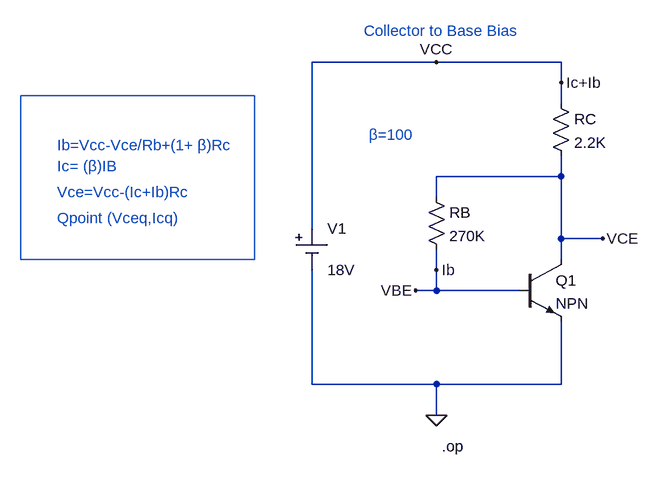
[diagram p0: schematic collector_base_bias.asc]
collector_base_bias.asc, the LTspice schematic file:
Version 4
SHEET 1 880 680
WIRE 288 0 96 0
WIRE 480 0 288 0
WIRE 480 32 480 0
WIRE 480 64 480 32
WIRE 480 176 480 144
WIRE 480 176 288 176
WIRE 288 208 288 176
WIRE 96 256 96 0
WIRE 480 272 480 176
WIRE 544 272 480 272
WIRE 480 304 480 272
WIRE 288 320 288 288
WIRE 288 352 288 320
WIRE 288 352 256 352
WIRE 416 352 288 352
WIRE 96 496 96 320
WIRE 288 496 96 496
WIRE 480 496 480 400
WIRE 480 496 288 496
WIRE 288 544 288 496
FLAG 288 544 0
FLAG 288 0 VCC
FLAG 544 272 VCE
FLAG 256 352 VBE
FLAG 288 320 Ib
FLAG 480 32 Ic+Ib
SYMBOL npn 416 304 R0
SYMATTR InstName Q1
SYMBOL res 272 192 R0
SYMATTR InstName RB
SYMATTR Value 270K
SYMBOL res 464 48 R0
SYMATTR InstName RC
SYMATTR Value 2.2K
SYMBOL Misc/cell 96 256 R0
SYMATTR InstName V1
SYMATTR Value 18V
TEXT 296 592 Left 2 !.op
TEXT 176 -48 Left 2 ;Collector to Base Bias
TEXT -296 128 Left 2 ;Ib=Vcc-Vce/Rb+(1+ β)Rc
TEXT -296 160 Left 2 ;Ic= (β)IB
TEXT -296 200 Left 2 ;Vce=Vcc-(Ic+Ib)Rc
TEXT -296 240 Left 2 ;Qpoint (Vceq,Icq)
TEXT 184 112 Left 2 ;β=100
RECTANGLE Normal -352 52 8 304

The netlist it stands for:
* collector_base_bias.asc
Q1 VCE Ib 0 0 NPN
RB VCE Ib 270K
RC Ic+Ib VCE 2.2K
V1 Ic+Ib 0 18V
.model NPN NPN
.model PNP PNP
.lib standard.bjt
.op
* Collector to Base Bias
* Ib=Vcc-Vce/Rb+(1+ β)Rc
* Ic= (β)IB
* Vce=Vcc-(Ic+Ib)Rc
* Qpoint (Vceq,Icq)
* β=100
.backanno
.end